# Altium schematic sheet SensWear-Main.SchDoc
size A4; Size: A4; SheetNumber: 1; SheetTotal: 8
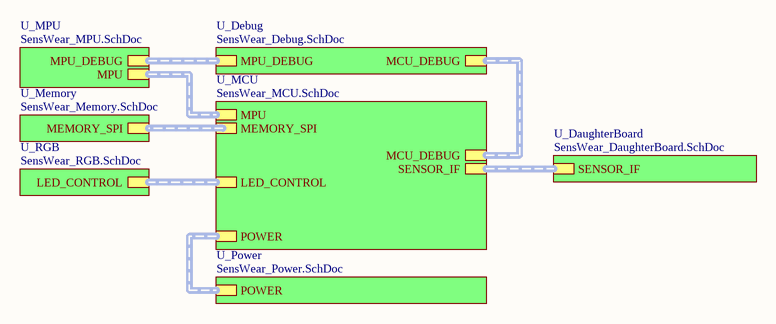
[diagram p0: SensWear-Main.SchDoc]

## Sub-sheets
U_DaughterBoard = SensWear_DaughterBoard.SchDoc: SENSOR_IF (harness SENSOR_IF)
U_Debug = SensWear_Debug.SchDoc: MPU_DEBUG (harness MPU_DEBUG), MCU_DEBUG (harness MCU_DEBUG)
U_MCU = SensWear_MCU.SchDoc: MEMORY_SPI (harness MEMORY_SPI), MPU (harness MPU), SENSOR_IF (harness SENSOR_IF), POWER (harness POWER), MCU_DEBUG (harness MCU_DEBUG), LED_CONTROL (harness LED_CONTROL)
U_Memory = SensWear_Memory.SchDoc: MEMORY_SPI (harness MEMORY_SPI)
U_MPU = SensWear_MPU.SchDoc: MPU (harness MPU), MPU_DEBUG (harness MPU_DEBUG)
U_Power = SensWear_Power.SchDoc: POWER (harness POWER)
U_RGB = SensWear_RGB.SchDoc: LED_CONTROL (harness LED_CONTROL)

## Buses and harness runs
harness sheet U_DaughterBoard/SENSOR_IF = sheet U_MCU/SENSOR_IF
harness sheet U_Debug/MCU_DEBUG = sheet U_MCU/MCU_DEBUG
harness sheet U_Debug/MPU_DEBUG = sheet U_MPU/MPU_DEBUG
harness sheet U_MCU/LED_CONTROL = sheet U_RGB/LED_CONTROL
harness sheet U_MCU/MEMORY_SPI = sheet U_Memory/MEMORY_SPI
harness sheet U_MCU/MPU = sheet U_MPU/MPU
harness sheet U_MCU/POWER = sheet U_Power/POWER

## Notes on the sheet
- Designer/Engineer
- Drawn By
- Document Name
- Board Title
- Sheet
- of
- Size
- A4
- Approved By
- Rev.
- Date